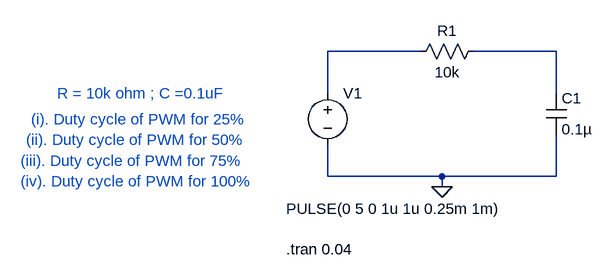
[diagram p0: schematic Draft1_25.asc]
Draft1_25.asc, the LTspice schematic file:
Version 4
SHEET 1 880 680
WIRE 160 64 16 64
WIRE 368 64 240 64
WIRE 16 128 16 64
WIRE 368 128 368 64
WIRE 16 256 16 208
WIRE 192 256 16 256
WIRE 368 256 368 192
WIRE 368 256 192 256
WIRE 192 272 192 256
FLAG 192 272 0
SYMBOL voltage 16 112 R0
WINDOW 3 -64 194 Left 2
WINDOW 123 0 0 Left 0
WINDOW 39 0 0 Left 0
SYMATTR Value PULSE(0 5 0 1u 1u 0.25m 1m)
SYMATTR InstName V1
SYMBOL cap 352 128 R0
SYMATTR InstName C1
SYMATTR Value 0.1µ
SYMBOL res 256 48 R90
WINDOW 0 0 56 VBottom 2
WINDOW 3 32 56 VTop 2
SYMATTR InstName R1
SYMATTR Value 10k
TEXT -48 368 Left 2 !.tran 0.04
TEXT -400 128 Left 2 ;R = 10k ohm ; C =0.1uF
TEXT -440 168 Left 2 ;(i). Duty cycle of PWM for 25%
TEXT -448 200 Left 2 ;(ii). Duty cycle of PWM for 50%
TEXT -456 232 Left 2 ;(iii). Duty cycle of PWM for 75%
TEXT -456 264 Left 2 ;(iv). Duty cycle of PWM for 100%

The netlist it stands for:
* Draft1_25.asc
V1 N001 0 PULSE(0 5 0 1u 1u 0.25m 1m)
C1 N002 0 0.1µ
R1 N002 N001 10k
.tran 0.04
* R = 10k ohm ; C =0.1uF
* (i). Duty cycle of PWM for 25%
* (ii). Duty cycle of PWM for 50%
* (iii). Duty cycle of PWM for 75%
* (iv). Duty cycle of PWM for 100%
.backanno
.end